# Altium schematic sheet Venato_Schematic_v1.SchDoc (part 1 of 3)
size 594 x 420 mm; SheetNumber: 1; SheetTotal: 1
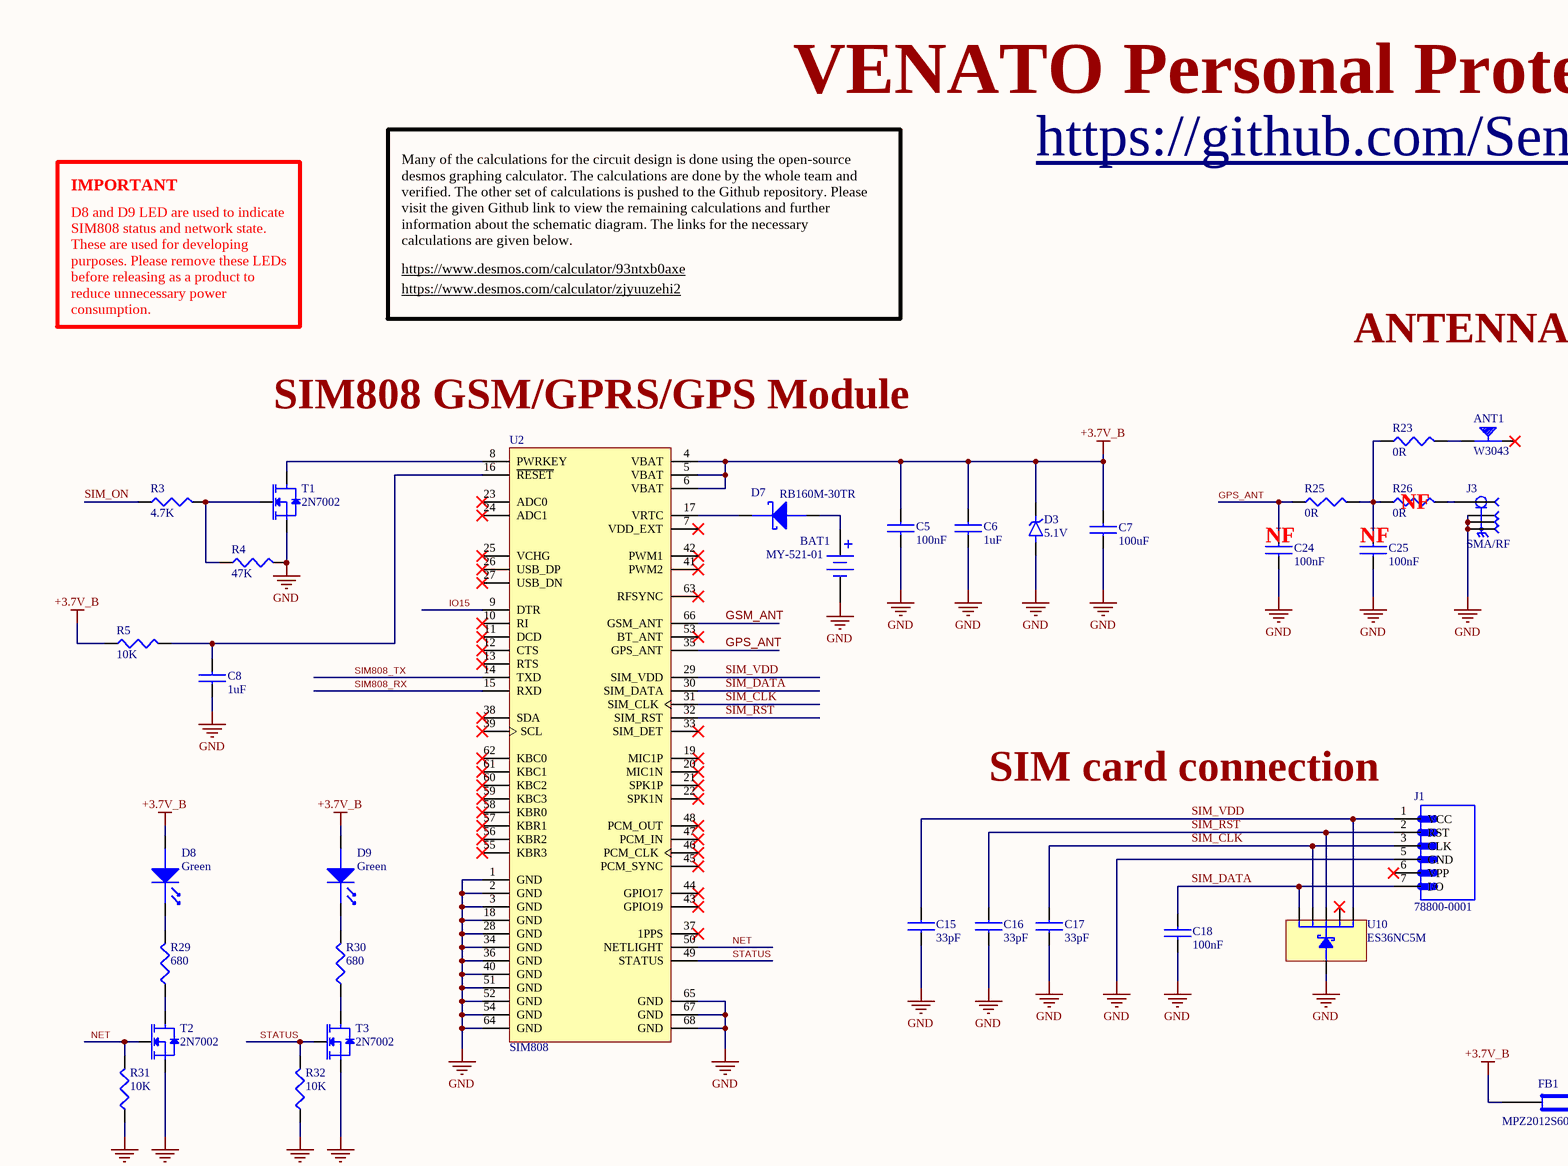
[diagram p0: Venato_Schematic_v1.SchDoc, top left]
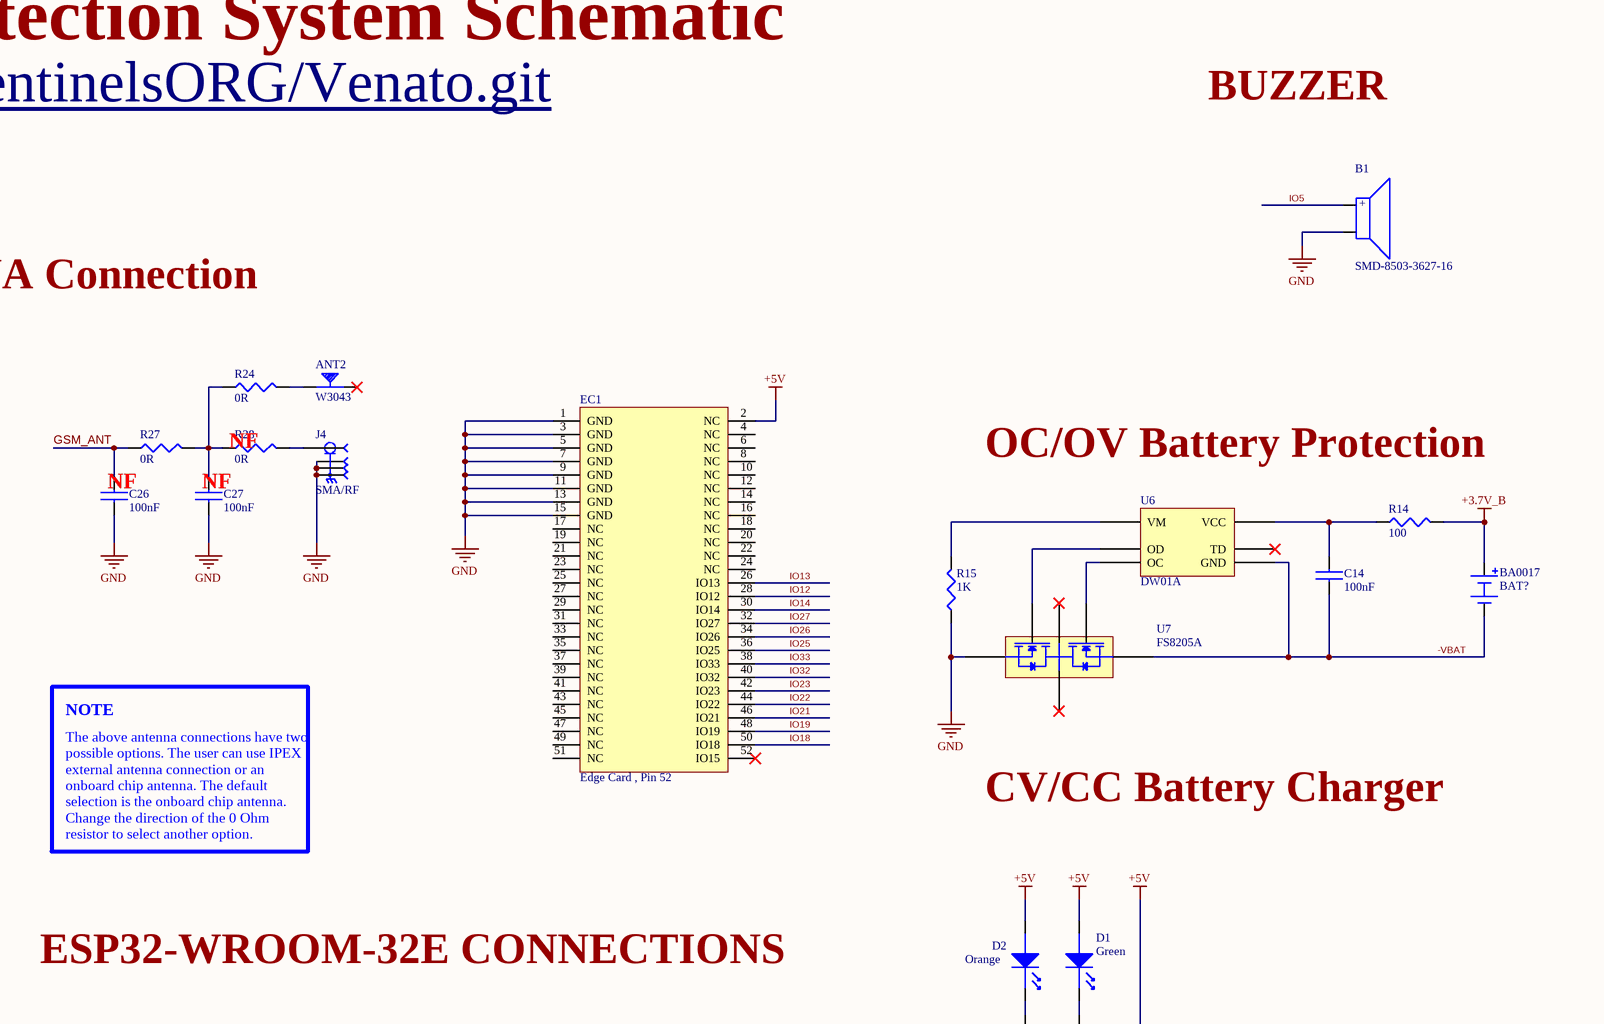
[diagram p1: Venato_Schematic_v1.SchDoc, top right]
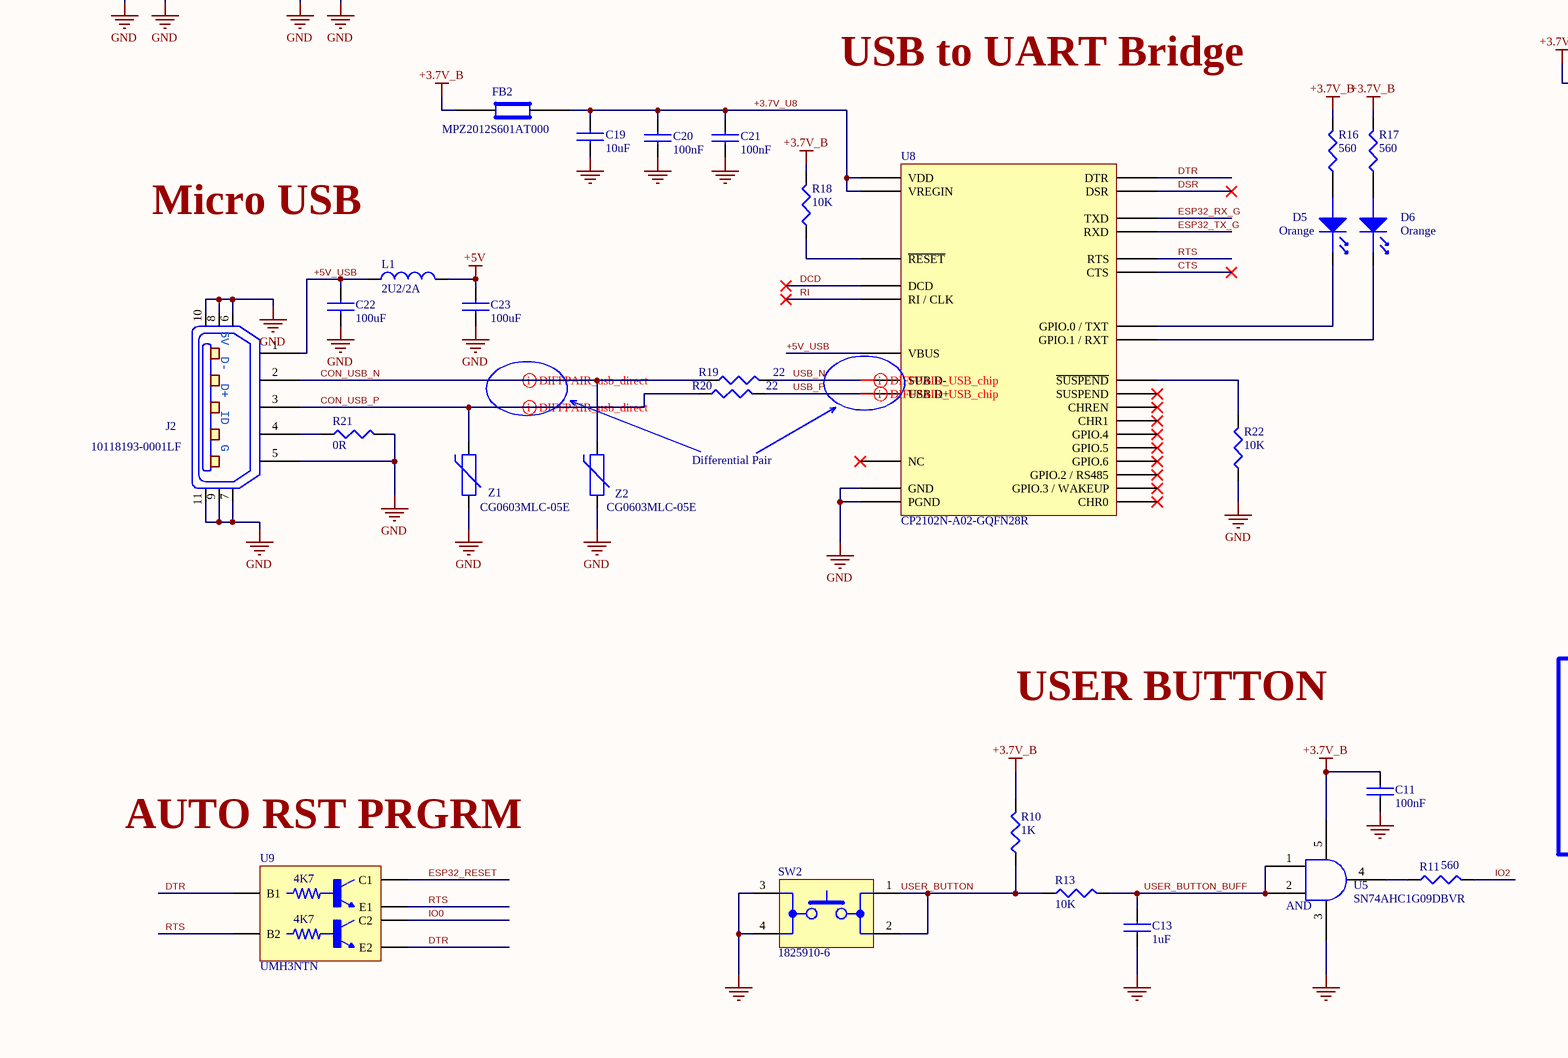
[diagram p2: Venato_Schematic_v1.SchDoc, bottom left]
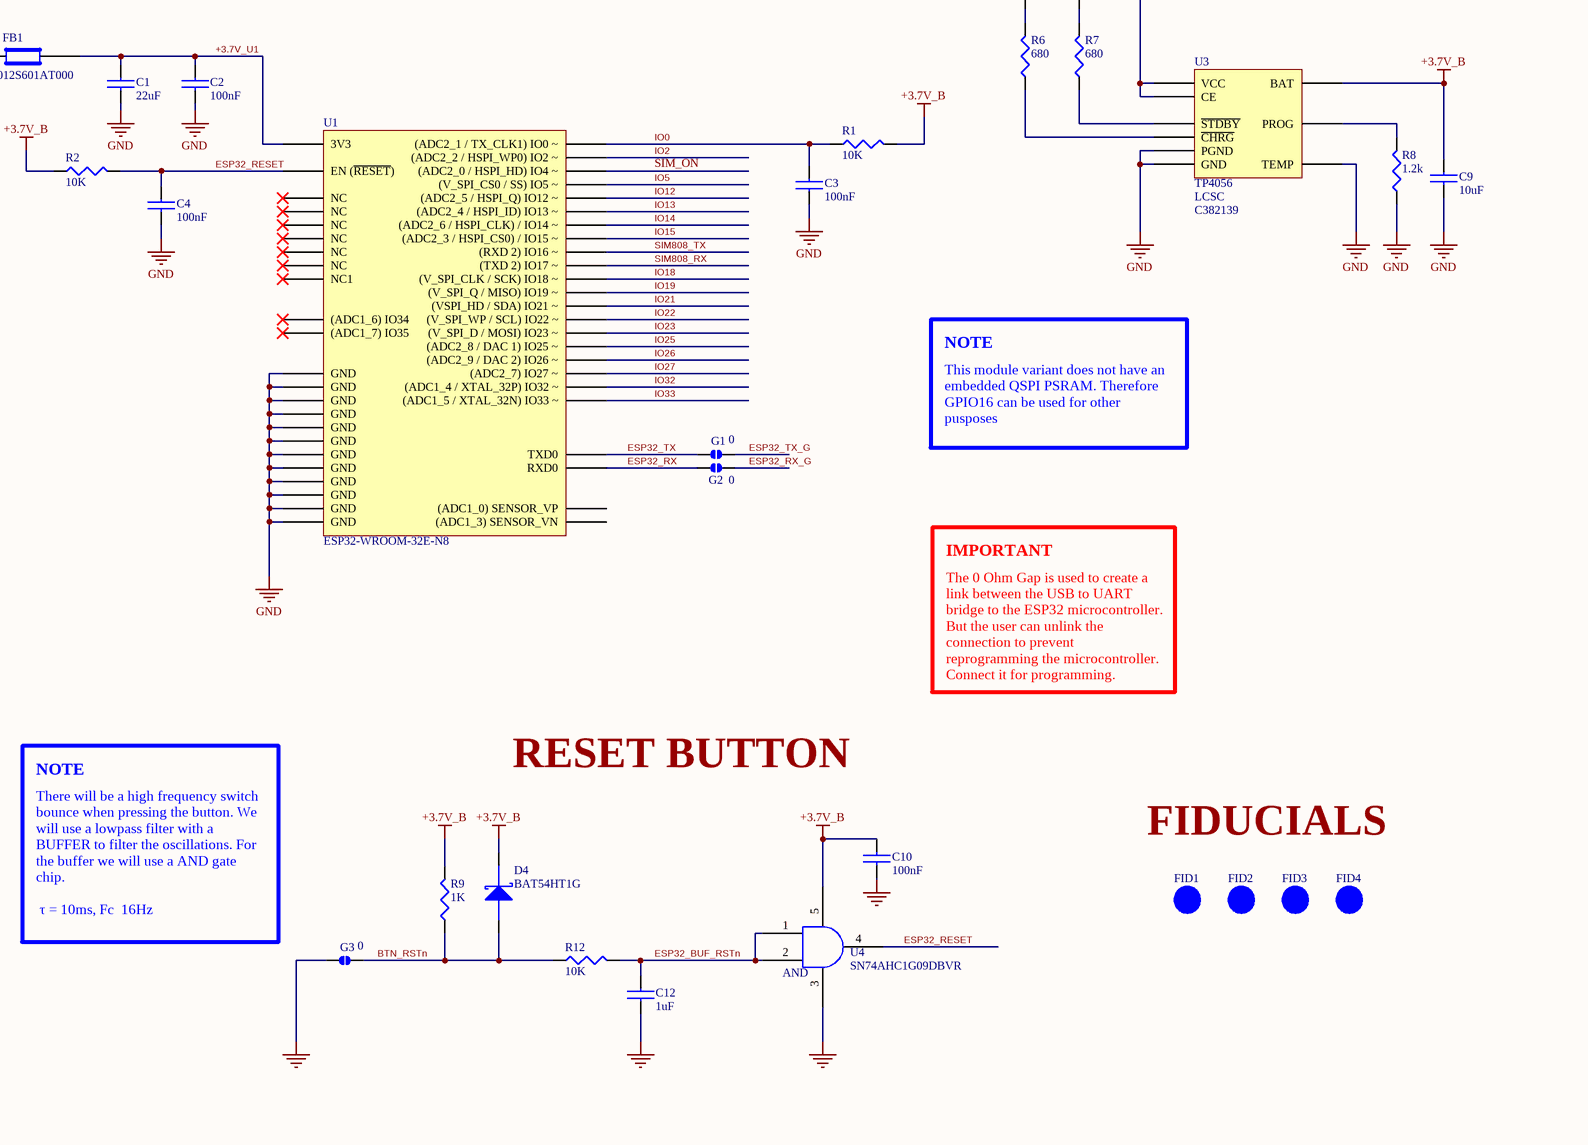
[diagram p3: Venato_Schematic_v1.SchDoc, bottom right]

## Parts
ANT1  W3043  [W3010]
ANT2  W3043  [W3010]
B1  SMD-8503-3627-16  [SMD-8503-3627-16O]
BA0017  BAT?  [Battery]
BAT1  MY-521-01  [My-521-01]
C1  22uF  [C0805]
C2  100nF  [C0805]
C3  100nF  [C0805]
C4  100nF  [C0805]
C5  100nF  [C0805]
C6  1uF  [C0805]
C7  100uF  [C0805]
C8  1uF  [C0805]
C9  10uF  [C0805]
C10  100nF  [C0805]
C11  100nF  [C0805]
C12  1uF  [C0805]
C13  1uF  [C0805]
C14  100nF  [C0805]
C15  33pF  [C0805]
C16  33pF  [C0805]
C17  33pF  [C0805]
C18  100nF  [C0805]
C19  10uF  [C0805]
C20  100nF  [C0805]
C21  100nF  [C0805]
C22  100uF  [C0805]
C23  100uF  [C0805]
C24  100nF  [C0805]
C25  100nF  [C0805]
C26  100nF  [C0805]
C27  100nF  [C0805]
D1  Green  [LED0603]
D2  Orange  [LED0603]
D3  5.1V  [SOD323]
D4  BAT54HT1G  [SOD323]
D5  Orange  [LED0603]
D6  Orange  [LED0603]
D7  RB160M-30TR  [SOD123]
D8  Green  [LED0603]
D9  Green  [LED0603]
EC1  Edge Card , Pin 52  [Edge Connector]
FB1  MPZ2012S601AT000  [C0805]
FB2  MPZ2012S601AT000  [C0805]
FID1  FID_1MM  [FID_x_420]  (value not drawn)  (no BOM)
FID2  FID_1MM  [FID_x_420]  (value not drawn)  (no BOM)
FID3  FID_1MM  [FID_x_420]  (value not drawn)  (no BOM)
FID4  FID_1MM  [FID_x_420]  (value not drawn)  (no BOM)
G1  0  [R0805_no_3d]
G2  0  [R0805_no_3d]
G3  0  [R0805_no_3d]
J1  78800-0001  [SIM]
J2  10118193-0001LF  [10118193-0001LF]
J3  SMA/RF  [IPEX_20579-001E]
J4  SMA/RF  [IPEX_20579-001E]
L1  2U2/2A  [CL_inductor]
R1  10K  [R0805]
R2  10K  [R0805]
R3  4.7K  [R0805]
R4  47K  [R0805]
R5  10K  [R0805]
R6  680  [R0805]
R7  680  [R0805]
R8  1.2k  [R0805]
R9  1K  [R0805]
R10  1K  [R0805]
R11  560  [R0805]
R12  10K  [R0805]
R13  10K  [R0805]
R14  100  [R0805]
R15  1K  [R0805]
R16  560  [R0805]
R17  560  [R0805]
R18  10K  [R0805]
R19  22  [R0805]
R20  22  [R0805]
R21  0R  [R0805]
R22  10K  [R0805]
R23  0R  [R0805]
R24  0R  [R0805]
R25  0R  [R0805]
R26  0R  [R0805]
R27  0R  [R0805]
R28  0R  [R0805]
R29  680  [R0805]
R30  680  [R0805]
R31  10K  [R0805]
R32  10K  [R0805]
SW2  1825910-6  [DIP41825910-6]
T1  2N7002  [TRANS_MMBT2907A]
T2  2N7002  [TRANS_MMBT2907A]
T3  2N7002  [TRANS_MMBT2907A]
U1  ESP32-WROOM-32E-N8  [XCVR_ESP32-WROOM-32E_(16MB)]
U2  SIM808  [XCVR_SIM808]
U3  TP4056  Supplier 1: LCSC  Supplier Part Number 1: C382139  [SOP_8]
U4  SN74AHC1G09DBVR  [DBV_SOT_5]
U5  SN74AHC1G09DBVR  [DBV_SOT_5]
U6  DW01A  [SOT23-6]
U7  FS8205A  [SOT23-6]
U8  CP2102N-A02-GQFN28R  [WFQFN-28]
U9  UMH3NTN  [SOT-363]
U10  ES36NC5M  [SOT-363]
Z1  CG0603MLC-05E  [R0603]
Z2  CG0603MLC-05E  [R0603]

## Nets
+3.7V_B: BA0017.1 C5.2 C6.2 C7.2 C9.2 C10.2 C11.2 D3.1 D4.1(Ca) D8.2(An) D9.2(An) FB1.1 FB2.1 R1.1 R2.1 R5.1 R9.2 R10.2 R14.2 R16.2 R17.2 R18.2 U2.4(VBAT) U2.5(VBAT) U2.6(VBAT) U3.5(BAT) U4.5 U5.5
+5V: C23.2 D1.2(An) D2.2(An) EC1.2(NC) L1.2 U3.4(VCC) U3.8(CE)
GND: B1.2 BAT1.2 C1.1 C2.1 C3.1 C4.1 C5.1 C6.1 C7.1 C8.1 C9.1 C10.1 C11.1 C12.2 C13.2 C15.1 C16.1 C17.1 C18.1 C19.1 C20.1 C21.1 C22.1 C23.1 C24.1 C25.1 C26.1 C27.1 D3.2 EC1.1(GND) EC1.3(GND) EC1.5(GND) EC1.7(GND) EC1.9(GND) EC1.11(GND) EC1.13(GND) EC1.15(GND) G3.1 J1.5(GND) J2.5 J2.6 J2.7 J2.8 J2.9 J2.10 J2.11 J3.G1(GROUND) J3.G2(GROUND) J3.G3(GROUND) J4.G1(GROUND) J4.G2(GROUND) J4.G3(GROUND) R4.2 R8.1 R15.1 R21.2 R22.1 R31.1 R32.1 SW2.3 SW2.4 T1.1 T2.1 T3.1 U1.1(GND) U1.15(GND) U1.38(GND) U1.39_1(GND) U1.39_2(GND) U1.39_3(GND) U1.39_4(GND) U1.39_5(GND) U1.39_6(GND) U1.39_7(GND) U1.39_8(GND) U1.39_9(GND) U2.1(GND) U2.2(GND) U2.3(GND) U2.18(GND) U2.28(GND) U2.34(GND) U2.36(GND) U2.40(GND) U2.51(GND) U2.52(GND) U2.54(GND) U2.64(GND) U2.65(GND) U2.67(GND) U2.68(GND) U3.1(TEMP) U3.3(GND) U3.9(PGND) U4.3 U5.3 U7.1(S1) U8.3(GND) U8.29(PGND) U10.2 Z1.1 Z2.1
+3.7V_U1: C1.2 C2.2 FB1.2 U1.2(3V3)
+3.7V_U8: C19.2 C20.2 C21.2 FB2.2 U8.6(VDD) U8.7(VREGIN)
+5V_USB: C22.2 J2.1 L1.1 U8.8(VBUS)
-VBAT: BA0017.2 C14.1 U6.6(GND) U7.3(S2)
BTN_RSTn: D4.2(An) G3.2 R9.1 R12.1
CON_USB_N: J2.2 R19.1 Z2.2
CON_USB_P: J2.3 R20.1 Z1.2
CTS: U8.23(CTS)
DCD: U8.1(DCD)
DSR: U8.27(DSR)
DTR: U8.28(DTR) U9.2(B1) U9.4(E2)
ESP32_BUF_RSTn: C12.1 R12.2 U4.1 U4.2
ESP32_RESET: C4.2 R2.2 U1.3(EN_(~{RESET})) U4.4 U9.6(C1)
ESP32_RX: G2.1 U1.34(RXD0)
ESP32_RX_G: G2.2 U8.26(TXD)
ESP32_TX: G1.1 U1.35(TXD0)
ESP32_TX_G: G1.2 U8.25(RXD)
GPS_ANT: C24.2 R25.1 U2.35(GPS_ANT)
GSM_ANT: C26.2 R27.1 U2.66(GSM_ANT)
IO0: C3.2 R1.2 U1.25((ADC2_1_/_TX_CLK1)_IO0_~) U9.3(C2)
IO2: R11.2 U1.24((ADC2_2_/_HSPI_WP0)_IO2_~)
IO5: B1.1 U1.29((V_SPI_CS0_/_SS)_IO5_~)
IO12: EC1.28(IO12) U1.14((ADC2_5_/_HSPI_Q)_IO12_~)
IO13: EC1.26(IO13) U1.16((ADC2_4_/_HSPI_ID)_IO13_~)
IO14: EC1.30(IO14) U1.13((ADC2_6_/_HSPI_CLK)_/_IO14_~)
IO15: U1.23((ADC2_3_/_HSPI_CS0)_/_IO15_~) U2.9(DTR)
IO18: EC1.50(IO18) U1.30((V_SPI_CLK_/_SCK)_IO18_~)
IO19: EC1.48(IO19) U1.31((V_SPI_Q_/_MISO)_IO19_~)
IO21: EC1.46(IO21) U1.33((VSPI_HD_/_SDA)_IO21_~)
IO22: EC1.44(IO22) U1.36((V_SPI_WP_/_SCL)_IO22_~)
IO23: EC1.42(IO23) U1.37((V_SPI_D_/_MOSI)_IO23_~)
IO25: EC1.36(IO25) U1.10((ADC2_8_/_DAC_1)_IO25_~)
IO26: EC1.34(IO26) U1.11((ADC2_9_/_DAC_2)_IO26_~)
IO27: EC1.32(IO27) U1.12((ADC2_7)_IO27_~)
IO32: EC1.40(IO32) U1.8((ADC1_4_/_XTAL_32P)_IO32_~)
IO33: EC1.38(IO33) U1.9((ADC1_5_/_XTAL_32N)_IO33_~)
NET: R31.2 T2.3 U2.50(NETLIGHT)
RI: U8.2(RI_/_CLK)
RTS: U8.24(RTS) U9.1(E1) U9.5(B2)
SIM808_RX: U1.28((TXD_2)_IO17_~) U2.15(RXD)
SIM808_TX: U1.27((RXD_2)_IO16_~) U2.14(TXD)
SIM_CLK: C17.2 J1.3(CLK) U2.31(SIM_CLK) U10.3
SIM_DATA: C18.2 J1.7(I/O) U2.30(SIM_DATA) U10.1
SIM_ON: R3.1 U1.26((ADC2_0_/_HSPI_HD)_IO4_~)
SIM_RST: C16.2 J1.2(RST) U2.32(SIM_RST) U10.4
SIM_VDD: C15.2 J1.1(VCC) U2.29(SIM_VDD) U10.6
STATUS: R32.2 T3.3 U2.49(STATUS)
USB_N: R19.2 U8.5(SUB_D-)
USB_P: R20.2 U8.4(USB_D+)
USER_BUTTON: R10.1 R13.1 SW2.1 SW2.2
USER_BUTTON_BUFF: C13.1 R13.2 U5.1 U5.2
NetANT1_1: ANT1.1 R23.2
NetANT2_1: ANT2.1 R24.2
NetBAT1_1: BAT1.1 D7.2(An)
NetC8_2: C8.2 R5.2 U2.16(~{RESET})
NetC14_2: C14.2 R14.1 U6.5(VCC)
NetC25_2: C25.2 R23.1 R25.2 R26.1
NetC27_2: C27.2 R24.1 R27.2 R28.1
NetD1_1: D1.1(Ca) R7.2
NetD2_1: D2.1(Ca) R6.2
NetD5_1: D5.1(Ca) U8.19(GPIO.0_/_TXT)
NetD5_2: D5.2(An) R16.1
NetD6_1: D6.1(Ca) U8.18(GPIO.1_/_RXT)
NetD6_2: D6.2(An) R17.1
NetD7_1: D7.1(Ca) U2.17(VRTC)
NetD8_1: D8.1(Ca) R29.2
NetD9_1: D9.1(Ca) R30.2
NetJ2_4: J2.4 R21.1
NetJ3_1: J3.1(SIGNAL) R26.2
NetJ4_1: J4.1(SIGNAL) R28.2
NetR3_2: R3.2 R4.1 T1.3
NetR6_1: R6.1 U3.7(~{CHRG})
NetR7_1: R7.1 U3.6(~{STDBY})
NetR8_2: R8.2 U3.2(PROG)
NetR11_1: R11.1 U5.4
NetR15_2: R15.2 U6.2(VM)
NetR18_1: R18.1 U8.9(~{RESET})
NetR22_2: R22.2 U8.11(~{SUSPEND})
NetR29_1: R29.1 T2.2
NetR30_1: R30.1 T3.2
NetT1_2: T1.2 U2.8(PWRKEY)
NetU6_1: U6.1(OD) U7.6(G1)
NetU6_3: U6.3(OC) U7.4(G2)

Not connected (* = marked no-connect by the designer): ANT1 2*; ANT2 2*; EC1 4(NC) 6(NC) 8(NC) 10(NC) 12(NC) 14(NC) 16(NC) 17(NC) 18(NC) 19(NC) 20(NC) 21(NC) 22(NC) 23(NC) 24(NC) 25(NC) 27(NC) 29(NC) 31(NC) 33(NC) 35(NC) 37(NC) 39(NC) 41(NC) 43(NC) 45(NC) 47(NC) 49(NC) 51(NC) 52(IO15)*; J1 6(VPP)*; U1 4((ADC1_0)_SENSOR_VP) 5((ADC1_3)_SENSOR_VN) 6((ADC1_6)_IO34)* 7((ADC1_7)_IO35)* 17(NC)* 18(NC)* 19(NC)* 20(NC)* 21(NC)* 22(NC)* 32(NC1)*; U2 7(VDD_EXT)* 10(RI)* 11(DCD)* 12(CTS)* 13(RTS)* 19(MIC1P)* 20(MIC1N)* 21(SPK1P)* 22(SPK1N)* 23(ADC0)* 24(ADC1)* 25(VCHG)* 26(USB_DP)* 27(USB_DN)* 33(SIM_DET)* 37(1PPS)* 38(SDA)* 39(SCL)* 41(PWM2)* 42(PWM1)* 43(GPIO19)* 44(GPIO17)* 45(PCM_SYNC)* 46(PCM_CLK)* 47(PCM_IN)* 48(PCM_OUT)* 53(BT_ANT)* 55(KBR3)* 56(KBR2)* 57(KBR1)* 58(KBR0)* 59(KBC3)* 60(KBC2)* 61(KBC1)* 62(KBC0)* 63(RFSYNC)*; U6 4(TD)*; U7 2(D1/D2)* 5(D1/D2)*; U8 10(NC)* 12(SUSPEND)* 13(CHREN)* 14(CHR1)* 15(CHR0)* 16(GPIO.3_/_WAKEUP)* 17(GPIO.2_/_RS485)* 20(GPIO.6)* 21(GPIO.5)* 22(GPIO.4)*; U10 5*

## Layout directives
differential pair; differential pair class usb_direct: CON_USB_N, CON_USB_P
differential pair; differential pair class USB_chip: USB_N, USB_P

## Notes on the sheet
- VENATO Personal Protection System Schematic
- IMPORTANT
- https://github.com/SentinelsORG/Venato.git <https://github.com/Senhttps://github.com/SentinelsORG/Venato.gittinelsORG/Venato.git>
- BUZZER
- Many of the calculations for the circuit design is done using the open-source desmos graphing calculator. The calculations are done by the whole team and verified. The other set of calculations is pushed to the Github repository. Please visit the given Github link to view the remaining calculations and further information about the schematic diagram. The links for the necessary calculations are given below.
- https://www.desmos.com/calculator/93ntxb0axe
- D8 and D9 LED are used to indicate SIM808 status and network state. These are used for developing purposes. Please remove these LEDs before releasing as a product to reduce unnecessary power consumption.
- https://www.desmos.com/calculator/zjyuuzehi2
- ANTENNA Connection
- SIM808 GSM/GPRS/GPS Module
- (near C24) NF
- (near C25) NF
- (near R26) NF
- (near C26) NF
- (near C27) NF
- (near R28) NF
- OC/OV Battery Protection
- (near J1) SIM card connection
- NOTE
- CV/CC Battery Charger
- The above antenna connections have two possible options. The user can use IPEX external antenna connection or an onboard chip antenna. The default selection is the onboard chip antenna. Change the direction of the 0 Ohm resistor to select another option.
- ESP32-WROOM-32E CONNECTIONS
- USB to UART Bridge
- Micro USB
- This module variant does not have an embedded QSPI PSRAM. Therefore GPIO16 can be used for other pusposes
- Differential Pair
- The 0 Ohm Gap is used to create a link between the USB to UART bridge to the ESP32 microcontroller. But the user can unlink the connection to prevent reprogramming the microcontroller. Connect it for programming.
- USER BUTTON
- RESET BUTTON
- FIDUCIALS
- (near U9) AUTO RST PRGRM
- There will be a high frequency switch bounce when pressing the button. We will use a lowpass filter with a BUFFER to filter the oscillations. For the buffer we will use a AND gate chip.
  τ = 10ms, Fc  16Hz
- (in symbol 10118193-0001LF) 5V; D-; D+; ID; G
- (in symbol SMD-8503-3627-16) +
- (in symbol SN74AHC1G09DBVR) AND
- (in symbol UMH3NTN) 4K7